# Altium project Acoustics.PrjPcb
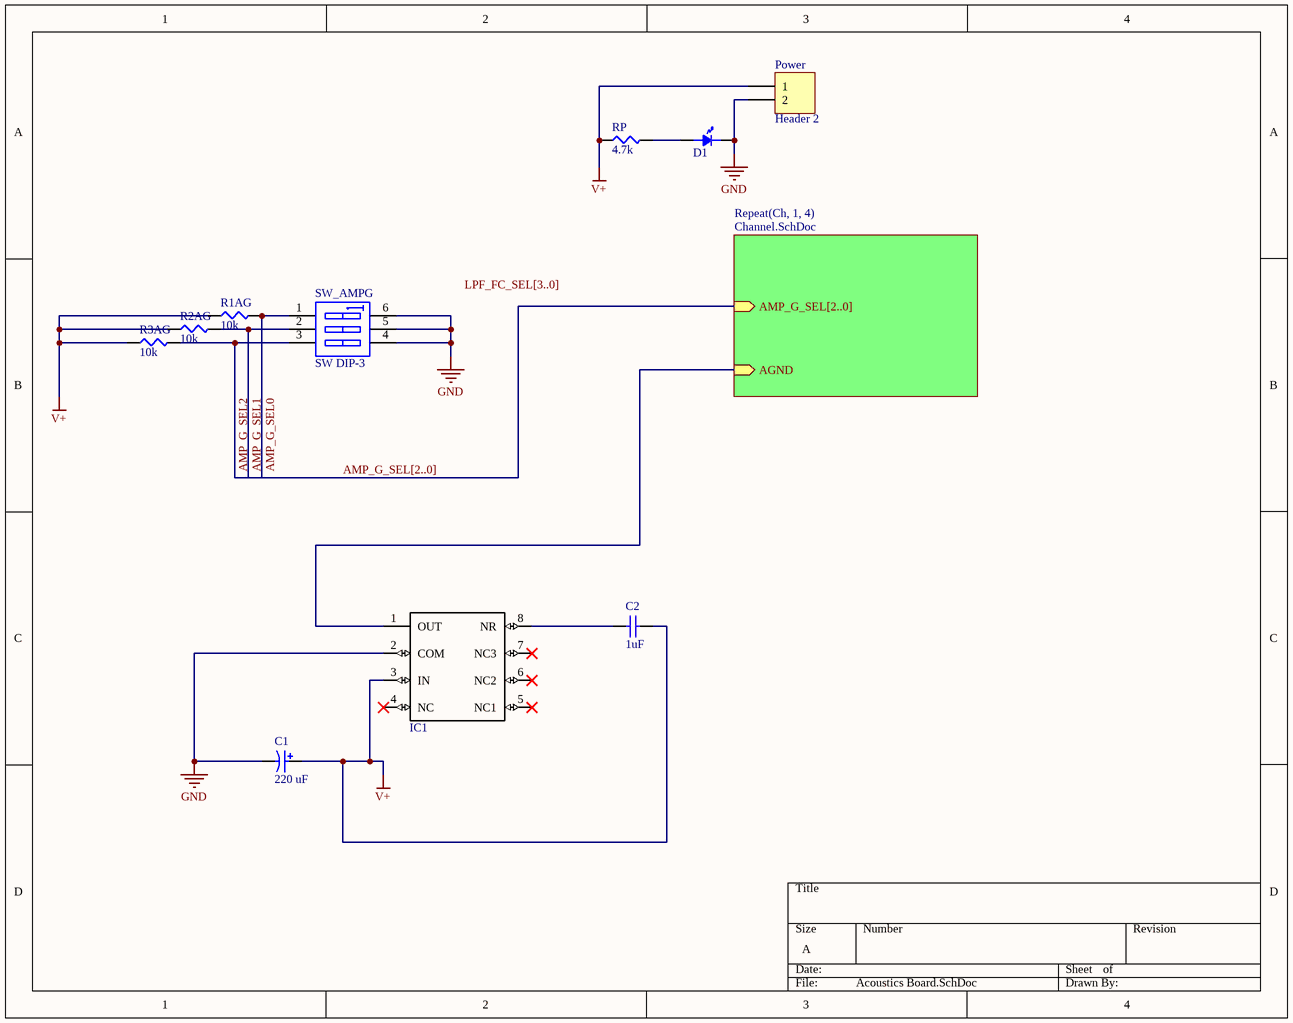
[diagram p0: Acoustics Board.SchDoc]
3 sheets, 50 parts. Net scope: hierarchical (ports join the sheet entries above them; power ports are global).
Board file: Acoustics Board.PcbDoc
Sheets:
  Acoustics Board.SchDoc
    Ch1 = Channel.SchDoc
      LPF = Low Pass Filter.SchDoc
    Ch2 = Channel.SchDoc
      LPF = Low Pass Filter.SchDoc
    Ch3 = Channel.SchDoc
      LPF = Low Pass Filter.SchDoc
    Ch4 = Channel.SchDoc
      LPF = Low Pass Filter.SchDoc

## Sheet Acoustics Board.SchDoc
size A

### Parts
C1  220 uF  [PNSC-FK-V-H13_V]
C2  value 1uF  [C0805]  (hidden comment: Cap)
D1  LED  [LED0805]  (value not drawn)
IC1  TLE2426  [SO8_M]  (value not drawn)
Power  Header 2  [HDR1X2]
R1AG  10k  [SMD-0805-RES]
R2AG  10k  [SMD-0805-RES]
R3AG  10k  [SMD-0805-RES]
RP  4.7k  [SMD-0805-RES]
SW_AMPG  SW DIP-3  [DIP-6]

### Sub-sheets
Repeat(Ch, 1, 4) = Channel.SchDoc: AMP_G_SEL[2..0] (in), AGND (in)

### Nets
GND: C1.2 D1.1 IC1.2(COM) Power.2 SW_AMPG.4(B3) SW_AMPG.5(B2) SW_AMPG.6(B1)
V+: C1.1 C2.1 IC1.3(IN) Power.1 R1AG.1 R2AG.1 R3AG.1 RP.1
AGND: IC1.1(OUT) ; sheet Repeat(Ch, 1, 4)/AGND
AMP_G_SEL0: R1AG.2 SW_AMPG.1(A1)
AMP_G_SEL1: R2AG.2 SW_AMPG.2(A2)
AMP_G_SEL2: R3AG.2 SW_AMPG.3(A3)
NetC2_2: C2.2 IC1.8(NR)
NetD1_2: D1.2 RP.2

Not connected (* = marked no-connect by the designer): IC1 4(NC)* 5(NC1)* 6(NC2)* 7(NC3)*

### Buses and harness runs
bus AMP_G_SEL[2..0] = sheet Repeat(Ch, 1, 4)/AMP_G_SEL[2..0]
bus LPF_FC_SEL[3..0]

### Notes on the sheet
- Labels drawn without touching a wire or pin: LPF_FC_SEL[3..0]

### Library data of the parts
C1 = CMP-2000-06222-1: Aluminum Electrolytic Capacitor, 220 uF, +/- 20%, 63 V, 2-Pin SMD (Size Code H13), -55 to 105 degC, RoHS, Tape and Reel; Manufacturer: Panasonic; Impedance: 0.16ohm; Life Time @ Temperature: 2000hours@105°C; Product Range: PANASONIC-?????FK; Voltage Rating: 63V; External Length / Height: 13.5mm; Ripple Current Temperature: 105°C; Ripple Current Frequency: 100kHz; Ripple Current AC: 800mA; Power Factor: 0.08; Power Factor Frequency: 120Hz; AE Capacitor Case: RadialCan-SMD; Capacitance: 220µF; Operating Lifetime: 2000h; SVHC: NoSVHC(16-Dec-2013); Diameter: 12.5mm; Package Description: 2-Pin Electrolytic Aluminum Capacitor, Body 13.5 x 13.5 mm; Height: 13.5mm; Package URL: http://industrial.panasonic.com/cdbs/www-data/pdf/RDE0000/DME0000COL48.pdf; Lifetime @ Temperature: 2000hours@105°C; Series: FK; Mounting Technology: SurfaceMount; Datasheet Version: 03/2016; Package / Case: H13; Voltage Rating V DC: 63V; Capacitance Tolerance ±: ±20%; Tolerance +: 20%; Capacitance Tolerance: ±20%; Package Reference: FK-V-H13; Datasheet URL: https://industrial.panasonic.com/cdbs/www-data/pdf/RDE0000/ABA0000C1181.pdf; Operating Temperature Range: -55°Cto+105°C; Manufacturer URL: http://www.panasonic.com/; Operating Temperature Min: -55°C; Capacitor Terminals: SMD; Packaging: CutTape; Operating Temperature Max: 105°C; Tolerance -: 20%; Operating life Time: 2000h; Capacitor Case Style: SMD
C2 = Cap: Unpolarized Capacitor
IC1 = TLE2426: in signal-conditioning applications utilizing a single power source a reference voltage equal to one-half the supply ...; MF: Texas Instruments; Price: None; SnapEDA_Link: https://www.snapeda.com/parts/TLE2426/Texas%20Instruments/view-part/?ref=snap; MP: TLE2426; Package: SOIC-8 Texas Instruments; Availability: Unavailable; Value: *
Power = Header 2: Header, 2-Pin; LatestRevisionDate: 17-Jul-2002; LatestRevisionNote: Re-released for DXP Platform.; Publisher: Altium Limited
R1AG R2AG R3AG RP = ERJ-6ENF1002V: RES SMD 10K OHM 1% 1/8W 0805; Manufacturer: Panasonic Electronic Components; Factory Stock: 0; Unit Price (USD): 0.00729; @ qty: 1500; Minimum Quantity: 1; Power (Watts): 0.125W, 1/8W; Temperature Coefficient: ±100ppm/°C; Part Number: ERJ-6ENF1002V; Datasheets: http://industrial.panasonic.com/www-cgi/jvcr13pz.cgi?E+PZ+3+AOA0002+ERJ6ENF1002V+7+WW; Image: //media.digikey.com/Renders/Panasonic%20Renders/ERJ-0805%20Pkg.jpg; Digi-Key Part Number: P10.0KCCT-ND; Quantity Available: 3985614; Packaging: Cut Tape (CT); Series: ERJ; Part Status: Active; Tolerance: ±1%; Composition: Thick Film; Features: Automotive AEC-Q200; Operating Temperature: -55°C ~ 155°C; Package / Case: 0805 (2012 Metric); Supplier Device Package: 0805; Size / Dimension: 0.079" L x 0.049" W (2.00mm x 1.25mm); Height - Seated (Max): 0.028" (0.70mm); Number of Terminations: 2; Failure Rate: -
  R1AG R2AG R3AG: Value: 10k
  RP: Value: 4.7k
SW_AMPG = SW DIP-3: DIP Switch, 3 Position, SPST; Published: 24-Mar-1999; LatestRevisionDate: 17-Jul-2002; LatestRevisionNote: Re-released for DXP Platform.; PackageReference: DIP-6; Publisher: Altium Limited; Code_JEDEC: MO-001-AM

## Sheet Channel.SchDoc
size A
Used 4 times, as channels Ch1, Ch2, Ch3, Ch4. Parts and nets are listed once, with the designators drawn on the sheet.
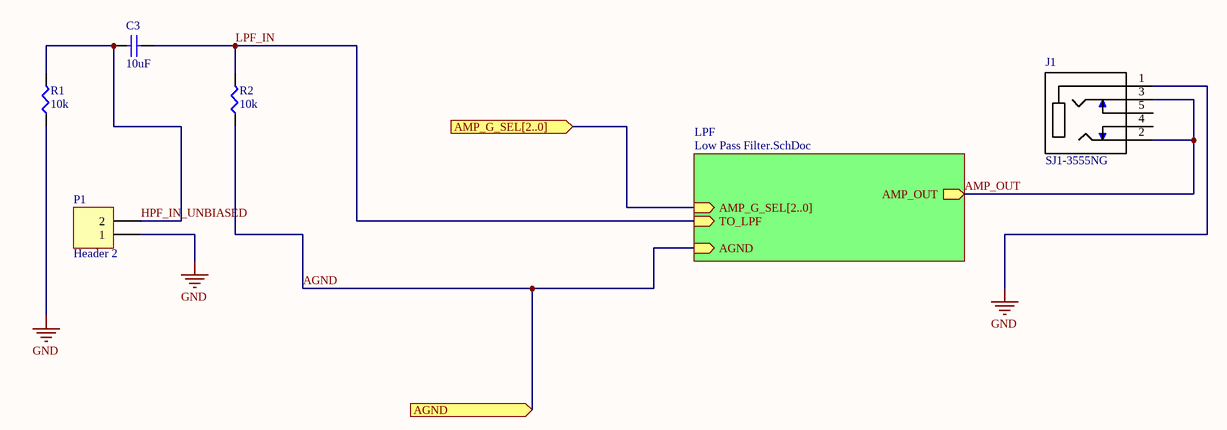
[diagram p1: Channel.SchDoc]

### Parts
C3  value 10uF  [C0805]  (hidden comment: Cap)
J1  SJ1-3555NG  [CUI_SJ1-3555NG]
P1  Header 2  [HDR1X2]
R1  10k  [SMD-0805-RES]
R2  10k  [SMD-0805-RES]

### Sub-sheets
LPF = Low Pass Filter.SchDoc: AMP_G_SEL[2..0] (in), TO_LPF (in), AMP_OUT (out), AGND (in)

### Ports
AGND (in), AMP_G_SEL[2..0] (in)

### Nets
GND: J1.1 P1.1 R1.1
AGND: R2.1 ; port AGND, sheet LPF/AGND
AMP_OUT: J1.2 J1.3 ; sheet LPF/AMP_OUT
HPF_IN_UNBIASED: C3.2 P1.2 R1.2
LPF_IN: C3.1 R2.2 ; sheet LPF/TO_LPF

Not connected (* = marked no-connect by the designer): J1 4 5

### Channels
Ch1: designators end in _Ch1; ports AGND=AGND
Ch2: designators end in _Ch2; ports AGND=AGND
Ch3: designators end in _Ch3; ports AGND=AGND
Ch4: designators end in _Ch4; ports AGND=AGND

### Buses and harness runs
bus port AMP_G_SEL[2..0] = sheet LPF/AMP_G_SEL[2..0]

### Library data of the parts
C3 = Cap: Unpolarized Capacitor
P1 = Header 2: Header, 2-Pin; LatestRevisionDate: 17-Jul-2002; LatestRevisionNote: Re-released for DXP Platform.; Publisher: Altium Limited
R1 R2 = ERJ-6ENF1002V: as R1AG on sheet Acoustics Board; Part Number: ERJ-6ENF1002V; Datasheets: http://industrial.panasonic.com/www-cgi/jvcr13pz.cgi?E+PZ+3+AOA0002+ERJ6ENF1002V+7+WW; Image: //media.digikey.com/Renders/Panasonic%20Renders/ERJ-0805%20Pkg.jpg; Digi-Key Part Number: P10.0KCCT-ND; Quantity Available: 3985614; Packaging: Cut Tape (CT); Series: ERJ; Part Status: Active; Value: 10k; Tolerance: ±1%; Composition: Thick Film; Features: Automotive AEC-Q200; Operating Temperature: -55°C ~ 155°C; Package / Case: 0805 (2012 Metric); Supplier Device Package: 0805; Size / Dimension: 0.079" L x 0.049" W (2.00mm x 1.25mm); Height - Seated (Max): 0.028" (0.70mm); Number of Terminations: 2; Failure Rate: -
J1 = SJ1-3555NG: Value: *

## Sheet Low Pass Filter.SchDoc
size A
Used 4 times, as channels Ch1/LPF, Ch2/LPF, Ch3/LPF, Ch4/LPF. Parts and nets are listed once, with the designators drawn on the sheet.
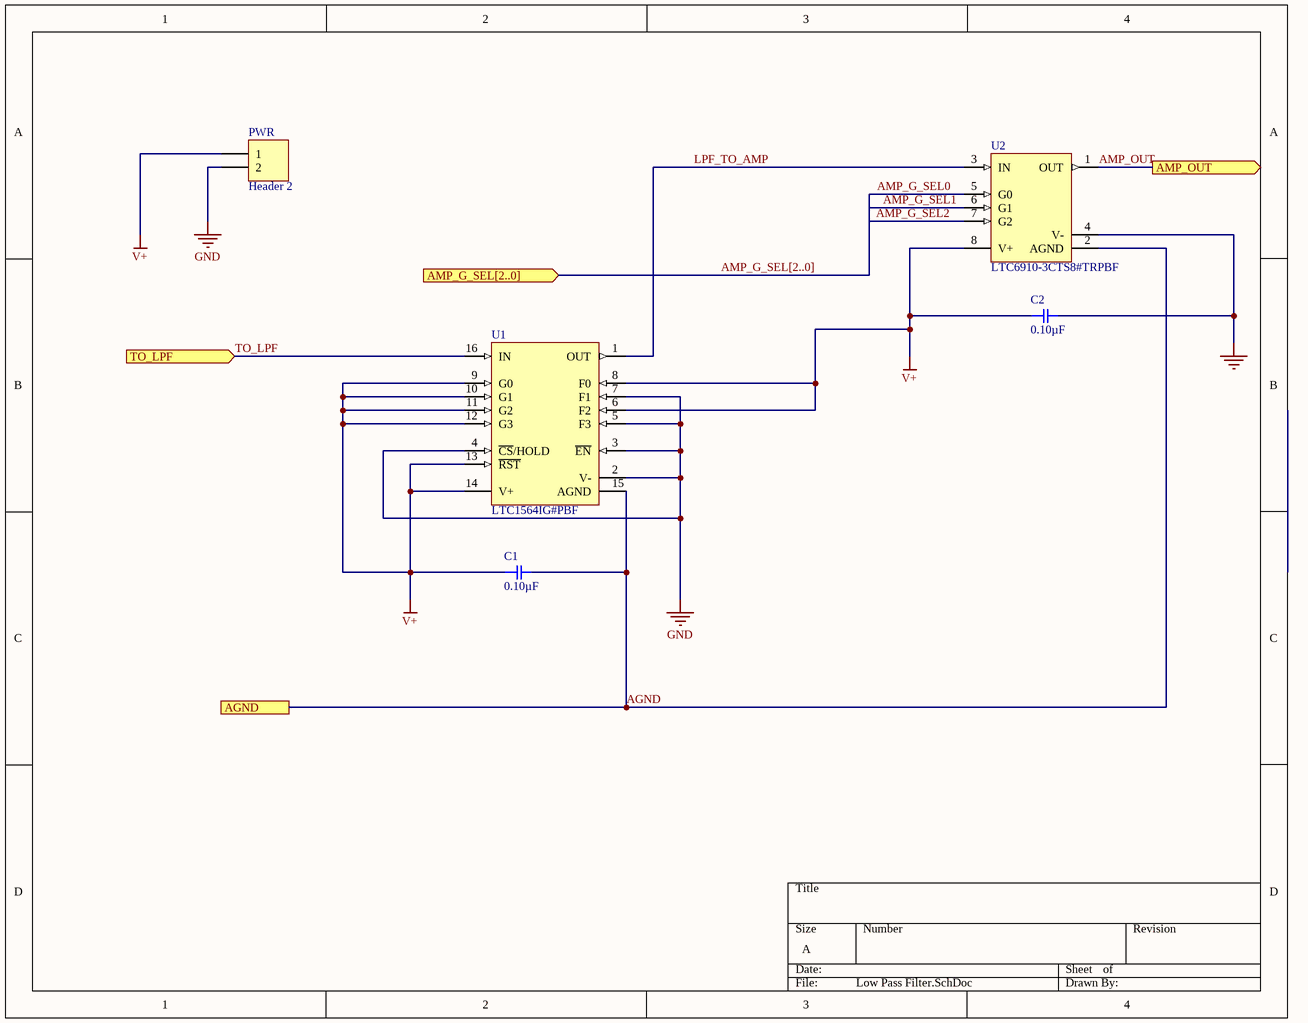
[diagram p2: Low Pass Filter.SchDoc]

### Parts
C1  0.10µF  [SMD-0805C]
C2  0.10µF  [SMD-0805C]
PWR  Header 2  [HDR1X2]
U1  LTC1564IG#PBF  [LT-G-16_M]
U2  LTC6910-3CTS8#TRPBF  [LT-TS8-8-TSOT-23_V]

### Ports
AGND, AMP_G_SEL[2..0] (in), AMP_OUT (out), TO_LPF (in)

### Nets
GND: C2.2 PWR.2 U1.2(V-) U1.3(~{EN}) U1.4(~{CS}/HOLD) U1.5(F3) U1.7(F1) U2.4(V-)
V+: C1.1 C2.1 PWR.1 U1.6(F2) U1.8(F0) U1.9(G0) U1.10(G1) U1.11(G2) U1.12(G3) U1.13(~{RST}) U1.14(V+) U2.8(V+)
AGND: C1.2 U1.15(AGND) U2.2(AGND) ; port AGND
AMP_G_SEL0: U2.5(G0)
AMP_G_SEL1: U2.6(G1)
AMP_G_SEL2: U2.7(G2)
AMP_OUT: U2.1(OUT) ; port AMP_OUT
LPF_TO_AMP: U1.1(OUT) U2.3(IN)
TO_LPF: U1.16(IN) ; port TO_LPF

### Channels
Ch1/LPF: designators end in _LPF1; ports AGND=AGND AMP_OUT=AMP_OUT_Ch1 TO_LPF=LPF_IN_Ch1
Ch2/LPF: designators end in _LPF2; ports AGND=AGND AMP_OUT=AMP_OUT_Ch2 TO_LPF=LPF_IN_Ch2
Ch3/LPF: designators end in _LPF3; ports AGND=AGND AMP_OUT=AMP_OUT_Ch3 TO_LPF=LPF_IN_Ch3
Ch4/LPF: designators end in _LPF4; ports AGND=AGND AMP_OUT=AMP_OUT_Ch4 TO_LPF=LPF_IN_Ch4

### Buses and harness runs
bus AMP_G_SEL[2..0] = port AMP_G_SEL[2..0]

### Library data of the parts
C1 C2 = GCD21BR71H104KA01L: CAP CER 0.1UF 50V X7R 0805; Manufacturer: Murata Electronics North America; Factory Stock: 0; Unit Price (USD): 0.24; Minimum Quantity: 1; Tolerance: ±10%; Datasheets: http://www.murata.com/~/media/webrenewal/support/library/catalog/products/capacitor/mlcc/c03e.ashx; Image: //media.digikey.com/Renders/Murata%20Renders/0805%28GxM6%29.jpg; Digi-Key Part Number: 490-11955-1-ND; Part Number: GCD21BR71H104KA01L; Quantity Available: 157; @ qty: 0; Packaging: Cut Tape (CT); Series: GCD; Part Status: Active; Value: 0.10µF; Voltage: 50V; Temperature Coefficient: X7R; Operating Temperature: -55°C ~ 125°C; Features: -; Ratings: AEC-Q200; Applications: Automotive; Mounting Type: Surface Mount, MLCC; Package / Case: 0805 (2012 Metric); Size / Dimension: 0.079" L x 0.049" W (2.00mm x 1.25mm); Height - Seated (Max): -; Thickness (Max): 0.049" (1.25mm); Lead Spacing: -; Lead Style: -
PWR = Header 2: Header, 2-Pin; LatestRevisionDate: 17-Jul-2002; LatestRevisionNote: Re-released for DXP Platform.; Publisher: Altium Limited
U1 = CMP-0359-00059-2: Single Channel, Digitally Controlled Antialiasing Filter and 4-Bit PGA, 0.15 MHz Typical GBW, 2.7 to 10.5 V, 16-Pin SOP (G16), Industrial, Pb-Free; Manufacturer: Linear Technology; Vs Max (V): 10.5; GBW (MHz) Typical: 0.15; Is (mA) Typical: 15; Channels (#): 1; Vos (mV) Typical: 3; Vs Min (V): 2.7; ComponentLink1Description: Manufacturer URL; ComponentLink2URL: http://cds.linear.com/docs/en/datasheet/1564fa.pdf; ComponentLink1URL: http://www.linear.com/; PackageReference: LT-G-16; Mounting Technology: Surface Mount; ComponentLink3URL: http://cds.linear.com/docs/en/packaging/SSOP_16_05-08-1640.pdf; Linear Technology Part Number: LTC1564; DatasheetVersion: Rev. A; Type: PGA; ComponentLink2Description: Datasheet; RoHS: Pb-Free; ComponentLink3Description: Package Specification; PackageDescription: 16-Lead Plastic SSOP, Body 6.2 x 5.3 mm, Pitch 0.65 mm; PartNumber: LTC1564IG#PBF; RevisionNote: URLs updated
U2 = CMP-0359-03721-2: Single Channel, Digitally Controlled Programmable Gain Amplifier, 11 MHz Typical GBW, 16 V/us Typical SR, 2.7 to 11 V, 8-Pin SOT23 (TS8-8), Commercial, Pb-Free, Reel; Manufacturer: Linear Technology; Channels (#): 1; Vos (mV) Typical: 3; Vs Min (V): 2.7; GBW (MHz) Typical: 11; SR (V/us) Typical: 16; Is (mA) Typical: 2; PartNumber: LTC6910-3CTS8#TRPBF; DatasheetVersion: Rev. A; PackageVersion: Rev A; ComponentLink2Description: Datasheet; ComponentLink3Description: Package Specification; PackageReference: LT-TS8-8-TSOT-23; Mounting Technology: Surface Mount; ComponentLink1Description: Manufacturer URL; Linear Technology Part Number: LTC6910-3; Packing: Reel; ComponentLink1URL: http://www.linear.com/; RevisionNote: URLs updated; RoHS: Pb-Free; Vs Max (V): 11; Code_JEDEC: MO-193; Type: PGA; ComponentLink3URL: http://cds.linear.com/docs/en/packaging/SOT_8_05-08-1637.pdf; PackageDescription: 8-Lead Plastic TSOT-23, Body 2.9 x 1.63 mm, Pitch 0.65 mm; ComponentLink2URL: http://cds.linear.com/docs/en/datasheet/6910123fa.pdf

## Nets that join several sheets
GND: Acoustics Board (7 pins), Ch1 (J1_Ch1.1 P1_Ch1.1 R1_Ch1.1), Ch1/LPF (8 pins), Ch2 (J1_Ch2.1 P1_Ch2.1 R1_Ch2.1), Ch2/LPF (8 pins), Ch3 (J1_Ch3.1 P1_Ch3.1 R1_Ch3.1), Ch3/LPF (8 pins), Ch4 (J1_Ch4.1 P1_Ch4.1 R1_Ch4.1), Ch4/LPF (8 pins)
V+: Acoustics Board (8 pins), Ch1/LPF (12 pins), Ch2/LPF (12 pins), Ch3/LPF (12 pins), Ch4/LPF (12 pins)
AGND: Acoustics Board (IC1.1), Ch1 (R2_Ch1.1), Ch1/LPF (C1_LPF1.2 U1_LPF1.15 U2_LPF1.2), Ch2 (R2_Ch2.1), Ch2/LPF (C1_LPF2.2 U1_LPF2.15 U2_LPF2.2), Ch3 (R2_Ch3.1), Ch3/LPF (C1_LPF3.2 U1_LPF3.15 U2_LPF3.2), Ch4 (R2_Ch4.1), Ch4/LPF (C1_LPF4.2 U1_LPF4.15 U2_LPF4.2)
AMP_G_SEL0: Acoustics Board (R1AG.2 SW_AMPG.1), Ch1/LPF (U2_LPF1.5), Ch2/LPF (U2_LPF2.5), Ch3/LPF (U2_LPF3.5), Ch4/LPF (U2_LPF4.5)
AMP_G_SEL1: Acoustics Board (R2AG.2 SW_AMPG.2), Ch1/LPF (U2_LPF1.6), Ch2/LPF (U2_LPF2.6), Ch3/LPF (U2_LPF3.6), Ch4/LPF (U2_LPF4.6)
AMP_G_SEL2: Acoustics Board (R3AG.2 SW_AMPG.3), Ch1/LPF (U2_LPF1.7), Ch2/LPF (U2_LPF2.7), Ch3/LPF (U2_LPF3.7), Ch4/LPF (U2_LPF4.7)
AMP_OUT_Ch1: Ch1 (J1_Ch1.2 J1_Ch1.3), Ch1/LPF (U2_LPF1.1)
AMP_OUT_Ch2: Ch2 (J1_Ch2.2 J1_Ch2.3), Ch2/LPF (U2_LPF2.1)
AMP_OUT_Ch3: Ch3 (J1_Ch3.2 J1_Ch3.3), Ch3/LPF (U2_LPF3.1)
AMP_OUT_Ch4: Ch4 (J1_Ch4.2 J1_Ch4.3), Ch4/LPF (U2_LPF4.1)
LPF_IN_Ch1: Ch1 (C3_Ch1.1 R2_Ch1.2), Ch1/LPF (U1_LPF1.16)
LPF_IN_Ch2: Ch2 (C3_Ch2.1 R2_Ch2.2), Ch2/LPF (U1_LPF2.16)
LPF_IN_Ch3: Ch3 (C3_Ch3.1 R2_Ch3.2), Ch3/LPF (U1_LPF3.16)
LPF_IN_Ch4: Ch4 (C3_Ch4.1 R2_Ch4.2), Ch4/LPF (U1_LPF4.16)